# Altium project Elkapod_power_supply.PrjPcb (part 5 of 6)

## Sheet Logic_controller.SchDoc
size A3; SheetNumber: 7; SheetTotal: 10
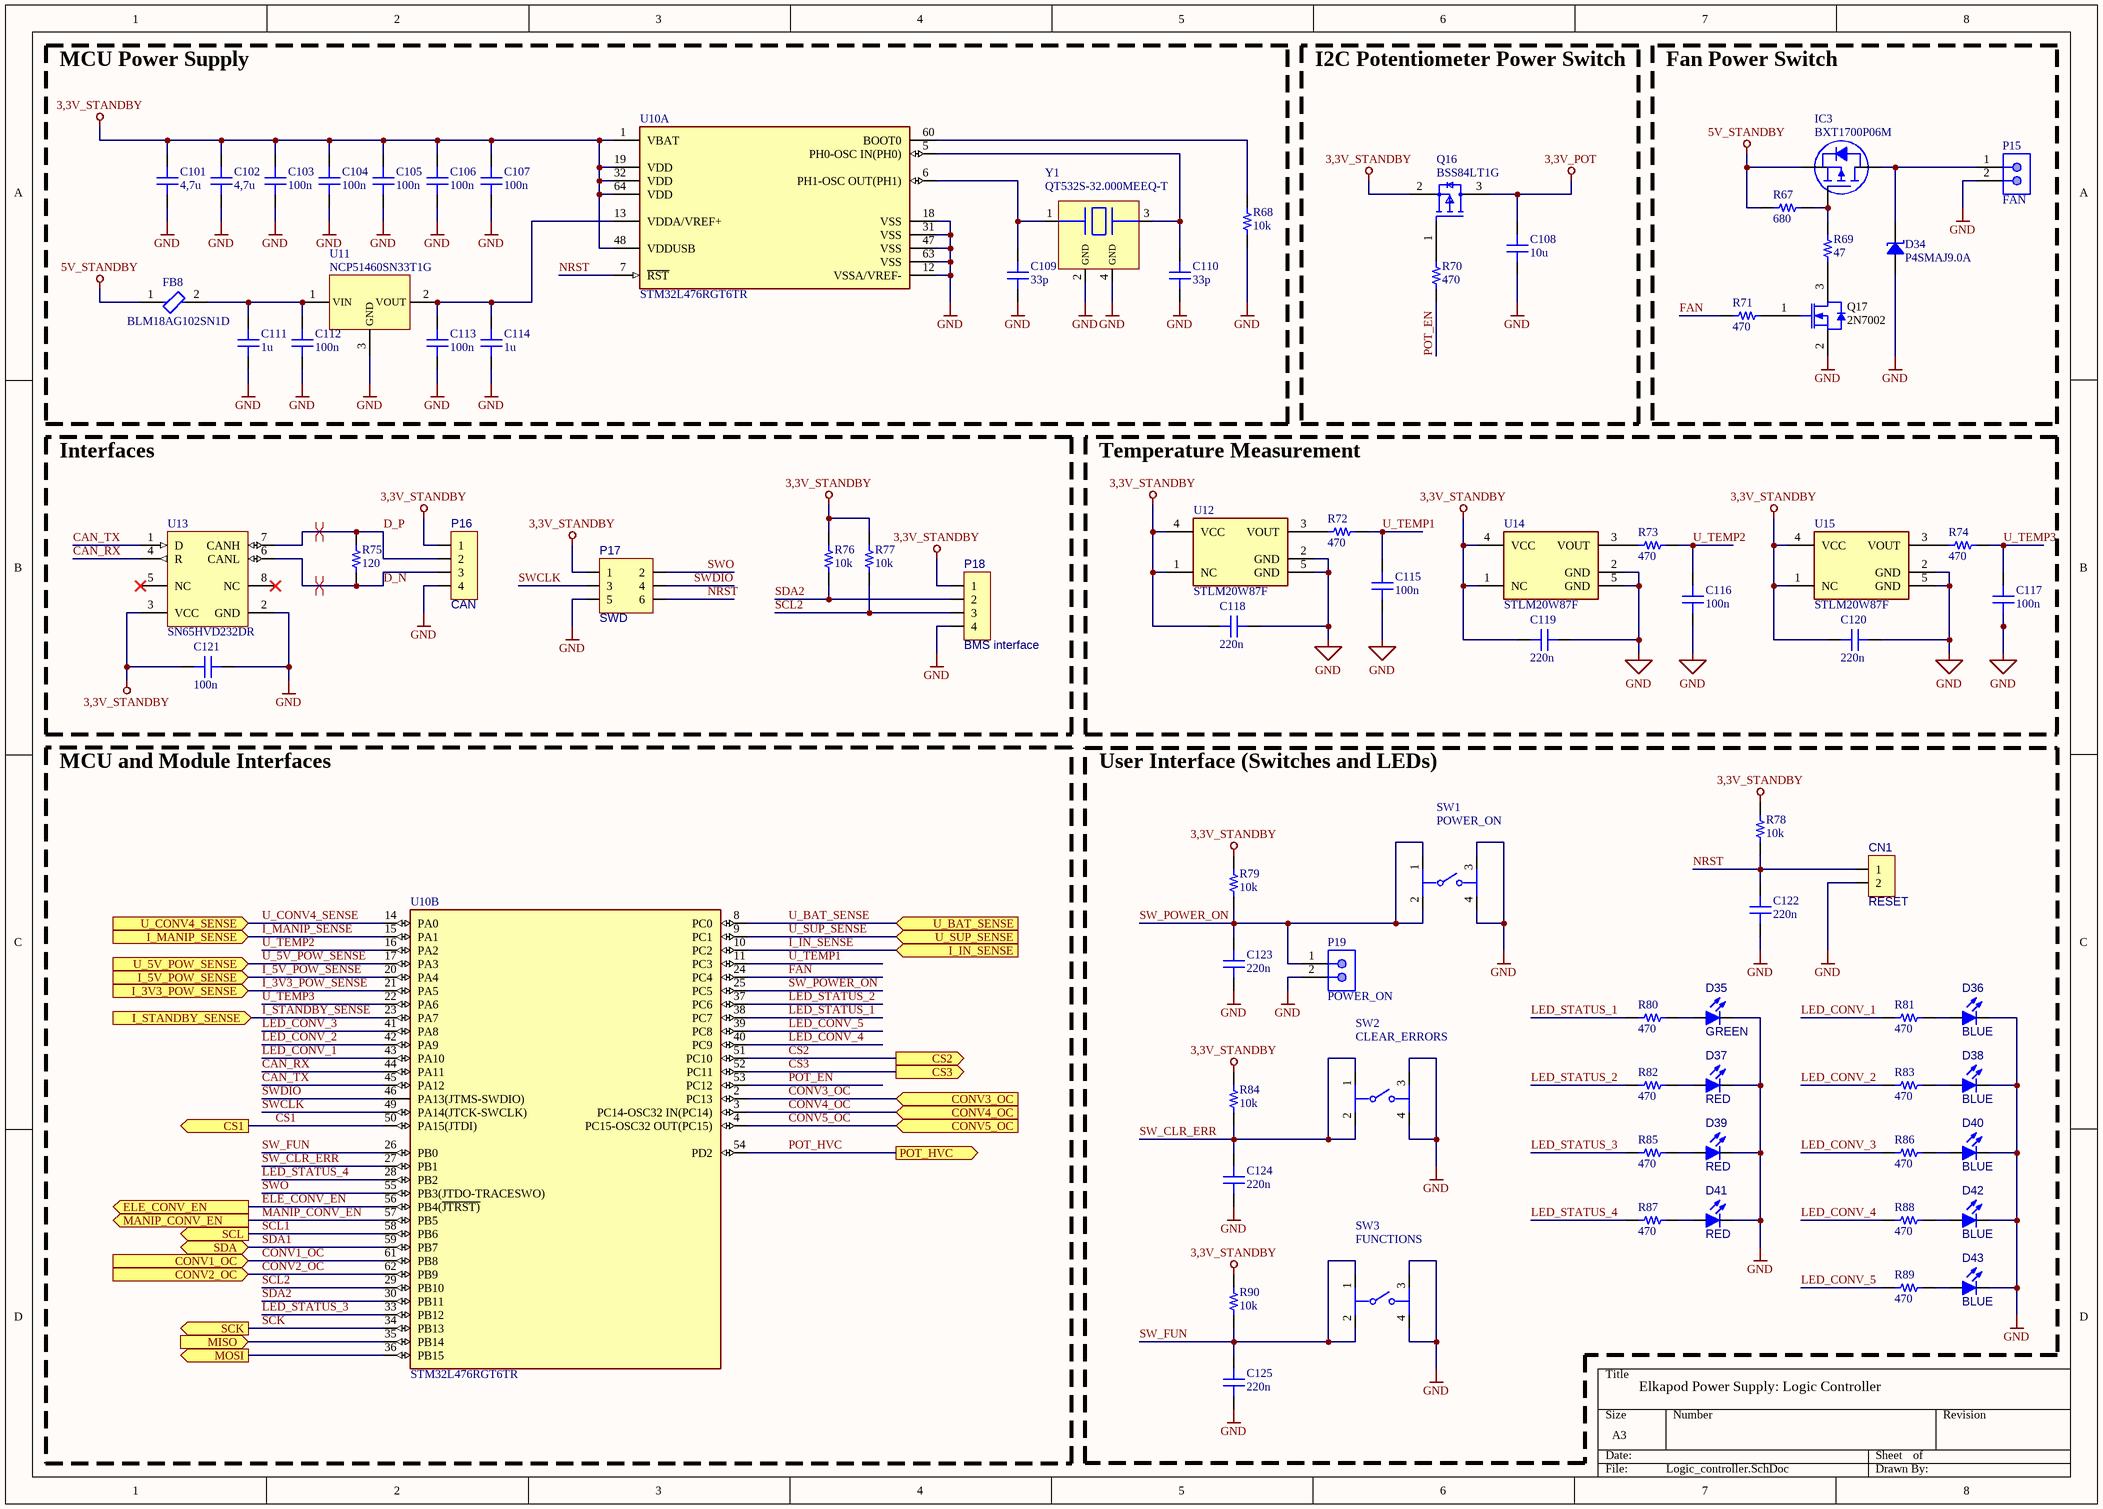
[diagram p9: Logic_controller.SchDoc]

### Parts
(Parts that share a designator on the sheet are numbered #1, #2 ... from top to bottom, then left to right.)
C101#2  4,7u  [CAP 0603_1608]
C102#2  4,7u  [CAP 0603_1608]
C103  100n  [CAP 0603_1608]
C104  100n  [CAP 0603_1608]
C105  100n  [CAP 0603_1608]
C106  100n  [CAP 0603_1608]
C107  100n  [CAP 0603_1608]
C108  10u  [CAP 0603_1608]
C109  33p  [CAP 0603_1608]
C110  33p  [CAP 0603_1608]
C111  1u  [CAP 0603_1608]
C112  100n  [CAP 0603_1608]
C113  100n  [CAP 0603_1608]
C114  1u  [CAP 0603_1608]
C115  100n  [CAP 0603_1608]
C116  100n  [CAP 0603_1608]
C117  100n  [CAP 0603_1608]
C118  220n  [CAP 0603_1608]
C119  220n  [CAP 0603_1608]
C120  220n  [CAP 0603_1608]
C121  100n  [CAP 0603_1608]
C122  220n  [CAP 0603_1608]
C123  220n  [CAP 0603_1608]
C124  220n  [CAP 0603_1608]
C125  220n  [CAP 0603_1608]
CN1  RESET  [GP_2x1]
D34  P4SMAJ9.0A  [DO214AC SMA]
D35  GREEN  [LED0805B]
D36  BLUE  [LED0805B]
D37  RED  [LED0805B]
D38  BLUE  [LED0805B]
D39  RED  [LED0805B]
D40  BLUE  [LED0805B]
D41  RED  [LED0805B]
D42  BLUE  [LED0805B]
D43  BLUE  [LED0805B]
FB8  BLM18AG102SN1D  [FP-BLM18-0_15-t0_8-MFG]
IC3  BXT1700P06M  [ON SEMI SOT-23-3]
P15  FAN  [MOLX-22-23-2021_V]
P16  CAN  [KK/2.54/4]
P17  SWD  [GP_3x2]
P18  BMS interface  [KK/2.54/4]
P19  POWER_ON  [MOLX-22-23-2021_V]
Q16#2  BSS84LT1G  [FP-318-08-IPC_A]
Q17  2N7002  [INF-PG-SOT23_M]
R67#2  680  [RES 0603_1608]
R68#2  10k  [RES 0603_1608]
R69#2  47  [RES 0603_1608]
R70#2  470  [RES 0603_1608]
R71#2  470  [RES 0603_1608]
R72#2  470  [RES 0603_1608]
R73#2  470  [RES 0603_1608]
R74  470  [RES 0603_1608]
R75  120  [RES 0603_1608]
R76  10k  [RES 0603_1608]
R77  10k  [RES 0603_1608]
R78  10k  [RES 0603_1608]
R79  10k  [RES 0603_1608]
R80  470  [RES 0603_1608]
R81  470  [RES 0603_1608]
R82  470  [RES 0603_1608]
R83  470  [RES 0603_1608]
R84  10k  [RES 0603_1608]
R85  470  [RES 0603_1608]
R86  470  [RES 0603_1608]
R87  470  [RES 0603_1608]
R88  470  [RES 0603_1608]
R89  470  [RES 0603_1608]
R90  10k  [RES 0603_1608]
SW1  POWER_ON  [FP-B3FS-1000-MFG]
SW2  CLEAR_ERRORS  [FP-B3FS-1000-MFG]
SW3  FUNCTIONS  [FP-B3FS-1000-MFG]
U10  STM32L476RGT6TR  [FP-LQFP64-5W-MFG]  (parts A,B of 2)
U11  NCP51460SN33T1G  [SOT23-3]
U12  STLM20W87F  [FP-SOT323-5L-7091413-MFG]
U13  SN65HVD232DR  [D0008A_M]
U14  STLM20W87F  [FP-SOT323-5L-7091413-MFG]
U15  STLM20W87F  [FP-SOT323-5L-7091413-MFG]
Y1  QT532S-32.000MEEQ-T  [QT532S_5,0x3,2_crystal]

### Blocks framed on the sheet
MCU Power Supply: C101#2 C102#2 C103-C107 C109-C114 FB8 R68#2 U10 U11 Y1
I2C Potentiometer Power Switch: C108 Q16#2 R70#2
Fan Power Switch: D34 IC3 P15 Q17 R67#2 R69#2 R71#2
Interfaces: C121 P16-P18 R75-R77 U13
Temperature Measurement: C115-C120 R72#2 R73#2 R74 U12 U14 U15
MCU and Module Interfaces: U10
User Interface (Switches and LEDs): C122-C125 CN1 D35-D43 P19 R78-R90 SW1-SW3

### Ports
CONV1_OC (in, see Elkapod_power_supply[8A]), CONV2_OC (in, see Elkapod_power_supply[8A]), CONV3_OC (in, see Elkapod_power_supply[8A]), CONV4_OC (in, see Elkapod_power_supply[8A]), CONV5_OC (in, see Elkapod_power_supply[8A]), CS1 (out, see Elkapod_power_supply[6A]), CS2 (out, see Elkapod_power_supply[6A]), CS3 (out, see Elkapod_power_supply[6A]), ELE_CONV_EN (out, see Elkapod_power_supply[8A]), I_3V3_POW_SENSE (in, see Elkapod_power_supply[6B]), I_5V_POW_SENSE (in, see Elkapod_power_supply[6B]), I_IN_SENSE (in, see Elkapod_power_supply[6A]), I_MANIP_SENSE (in, see Elkapod_power_supply[6A]), I_STANDBY_SENSE (in, see Elkapod_power_supply[6B]), MANIP_CONV_EN (out, see Elkapod_power_supply[8A]), MISO (in, see Elkapod_power_supply[6A], Servos_controller[4B]), MOSI (out, see Elkapod_power_supply[6A], Servos_controller[3B]), POT_HVC (out, see Elkapod_power_supply[8A]), SCK (out, see Elkapod_power_supply[6A]), SCL (out, see Elkapod_power_supply[6A], Controllable_voltage_outputs[2A], Electronics_power_supply_DC_converter[7C], Servos_controller[1C], Servos_DC_converter[5A]), SDA (bidir, see Elkapod_power_supply[6A], Controllable_voltage_outputs[2B], Electronics_power_supply_DC_converter[7C], Servos_controller[1C], Servos_DC_converter[5A]), U_5V_POW_SENSE (in, see Elkapod_power_supply[6A]), U_BAT_SENSE (in, see Elkapod_power_supply[6A]), U_CONV4_SENSE (in, see Elkapod_power_supply[6A]), U_SUP_SENSE (in, see Elkapod_power_supply[6A])

### Nets
3,3V_POT: C108.2 Q16#2.3(D)
3,3V_STANDBY: C101#2.2 C102#2.2 C103.2 C104.2 C105.2 C106.2 C107.2 C118.2 C119.2 C120.2 C121.2 P16.1 P17.1 P18.1 Q16#2.2(S) R76.1 R77.1 R78.1 R79.1 R84.1 R90.1 U10.1(VBAT) U10.19(VDD) U10.32(VDD) U10.48(VDDUSB) U10.64(VDD) U12.1(NC) U12.4(VCC) U13.3(VCC) U14.1(NC) U14.4(VCC) U15.1(NC) U15.4(VCC)
5V_STANDBY: FB8.1 IC3.2(S) R67#2.1
GND: C101#2.1 C102#2.1 C103.1 C104.1 C105.1 C106.1 C107.1 C108.1 C109.1 C110.1 C111.1 C112.1 C113.1 C114.1 C115.2 C116.2 C117.2 C118.1 C119.1 C120.1 C121.1 C122.1 C123.1 C124.1 C125.1 CN1.2 D34.1 D35.2(K) D36.2(K) D37.2(K) D38.2(K) D39.2(K) D40.2(K) D41.2(K) D42.2(K) D43.2(K) P15.2 P16.4 P17.5 P18.4 P19.2 Q17.2(SOURCE) R68#2.2 SW1.3 SW1.4 SW2.3 SW2.4 SW3.3 SW3.4 U10.12(VSSA/VREF-) U10.18(VSS) U10.31(VSS) U10.47(VSS) U10.63(VSS) U11.3(GND) U12.2(GND) U12.5(GND) U13.2(GND) U14.2(GND) U14.5(GND) U15.2(GND) U15.5(GND) Y1.2(GND) Y1.4(GND)  [project net AGND]
CAN_RX: U10.44(PA11) U13.4(R)  [project net CAN_RX_7]
CAN_TX: U10.45(PA12) U13.1(D)  [project net CAN_TX_7]
CONV1_OC: U10.61(PB8) ; port CONV1_OC
CONV2_OC: U10.62(PB9) ; port CONV2_OC
CONV3_OC: U10.2(PC13) ; port CONV3_OC
CONV4_OC: U10.3(PC14-OSC32_IN(PC14)) ; port CONV4_OC
CONV5_OC: U10.4(PC15-OSC32_OUT(PC15)) ; port CONV5_OC
CS1: U10.50(PA15(JTDI)) ; port CS1
CS2: U10.51(PC10) ; port CS2
CS3: U10.52(PC11) ; port CS3
D_N: P16.3 R75.2 U13.6(CANL)  [project net D_N_7]
D_P: P16.2 R75.1 U13.7(CANH)  [project net D_P_7]
ELE_CONV_EN: U10.56(PB4(~{JTRST)}) ; port ELE_CONV_EN
FAN: R71#2.1 U10.24(PC4)  [project net FAN_7]
I_3V3_POW_SENSE: U10.21(PA5) ; port I_3V3_POW_SENSE
I_5V_POW_SENSE: U10.20(PA4) ; port I_5V_POW_SENSE
I_IN_SENSE: U10.10(PC2) ; port I_IN_SENSE
I_MANIP_SENSE: U10.15(PA1) ; port I_MANIP_SENSE
I_STANDBY_SENSE: U10.23(PA7) ; port I_STANDBY_SENSE
LED_CONV_1: R81.2 U10.43(PA10)  [project net LED_CONV_1_7]
LED_CONV_2: R83.2 U10.42(PA9)  [project net LED_CONV_2_7]
LED_CONV_3: R86.2 U10.41(PA8)  [project net LED_CONV_3_7]
LED_CONV_4: R88.2 U10.40(PC9)  [project net LED_CONV_4_7]
LED_CONV_5: R89.2 U10.39(PC8)  [project net LED_CONV_5_7]
LED_STATUS_1: R80.2 U10.38(PC7)  [project net LED_STATUS_1_7]
LED_STATUS_2: R82.2 U10.37(PC6)  [project net LED_STATUS_2_7]
LED_STATUS_3: R85.2 U10.33(PB12)  [project net LED_STATUS_3_7]
LED_STATUS_4: R87.2 U10.28(PB2)  [project net LED_STATUS_4_7]
MANIP_CONV_EN: U10.57(PB5) ; port MANIP_CONV_EN
MISO: U10.35(PB14) ; port MISO
MOSI: U10.36(PB15) ; port MOSI
NRST: C122.2 CN1.1 P17.6 R78.2 U10.7(~{RST})  [project net NRST_7]
POT_EN: R70#2.2 U10.53(PC12)  [project net POT_EN_7]
POT_HVC: U10.54(PD2) ; port POT_HVC
SCK: U10.34(PB13) ; port SCK
SCL1: U10.58(PB6) ; port SCL  [project net SCL]
SCL2: P18.3 R77.2 U10.29(PB10)  [project net SCL2_7]
SDA1: U10.59(PB7) ; port SDA  [project net SDA]
SDA2: P18.2 R76.2 U10.30(PB11)  [project net SDA2_7]
SW_CLR_ERR: C124.2 R84.2 SW2.1 SW2.2 U10.27(PB1)  [project net SW_CLR_ERR_7]
SW_FUN: C125.2 R90.2 SW3.1 SW3.2 U10.26(PB0)  [project net SW_FUN_7]
SW_POWER_ON: C123.2 P19.1 R79.2 SW1.1 SW1.2 U10.25(PC5)  [project net SW_POWER_ON_7]
SWCLK: P17.3 U10.49(PA14(JTCK-SWCLK))  [project net SWCLK_7]
SWDIO: P17.4 U10.46(PA13(JTMS-SWDIO))  [project net SWDIO_7]
SWO: P17.2 U10.55(PB3(JTDO-TRACESWO))  [project net SWO_7]
U_5V_POW_SENSE: U10.17(PA3) ; port U_5V_POW_SENSE
U_BAT_SENSE: U10.8(PC0) ; port U_BAT_SENSE
U_CONV4_SENSE: U10.14(PA0) ; port U_CONV4_SENSE
U_SUP_SENSE: U10.9(PC1) ; port U_SUP_SENSE
U_TEMP1: C115.1 R72#2.2 U10.11(PC3)  [project net U_TEMP1_7]
U_TEMP2: C116.1 R73#2.2 U10.16(PA2)  [project net U_TEMP2_7]
U_TEMP3: C117.1 R74.2 U10.22(PA6)  [project net U_TEMP3_7]
NetC109_2: C109.2 U10.6(PH1-OSC_OUT(PH1)) Y1.1(OSC)
NetC110_2: C110.2 U10.5(PH0-OSC_IN(PH0)) Y1.3(OSC)
NetC111_2: C111.2 C112.2 FB8.2 U11.1(VIN)
NetC113_2: C113.2 C114.2 U10.13(VDDA/VREF+) U11.2(VOUT)
NetD34_2: D34.2 IC3.3(D) P15.1
NetD35_1: D35.1(A) R80.1
NetD36_1: D36.1(A) R81.1
NetD37_1: D37.1(A) R82.1
NetD38_1: D38.1(A) R83.1
NetD39_1: D39.1(A) R85.1
NetD40_1: D40.1(A) R86.1
NetD41_1: D41.1(A) R87.1
NetD42_1: D42.1(A) R88.1
NetD43_1: D43.1(A) R89.1
NetIC3_1: IC3.1(G) R67#2.2 R69#2.1
NetQ16#2_1: Q16#2.1(G) R70#2.1
NetQ17_1: Q17.1(GATE) R71#2.2
NetQ17_3: Q17.3(DRAIN) R69#2.2
NetR68#2_1: R68#2.1 U10.60(BOOT0)
NetR72#2_1: R72#2.1 U12.3(VOUT)
NetR73#2_1: R73#2.1 U14.3(VOUT)
NetR74_1: R74.1 U15.3(VOUT)

Not connected (* = marked no-connect by the designer): U13 5(NC)* 8(NC)*

### Layout directives
differential pair: D_N_7, D_P_7

### Notes on the sheet
- Elkapod Power Supply: Logic Controller

### Library data of the parts
C101#2 C102#2 = C0603C272F3GAC7867: CAP CER 4,7uF 25V X5R 0603; manufacturer: KEMET; Temperature Coefficient: C0G, NP0; Tolerance: ±1%; Part Number: C0603C272F3GAC7867; Value: 4,7u; Applications: General Purpose; Capacitance: 4,7u; componentlink1description: Datasheet; componentlink1url: https://api.kemet.com/component-edge/download/datasheet/C0603C272F3GACTU.pdf; componentlink2description: DigiKey Link; componentlink2url: https://www.digikey.com/en/products/detail/kemet/C0603C272F3GAC7867/2200413; Device Package: 0603 (1608 Metric); Features: Low ESL; lastupdated: 09.02.2024 20:10:30; Lifecycle Status: Active; Minimum Order: 1; Mounting Type: Surface Mount, MLCC; Operating Temperature: -55°C ~ 125°C; Package / Case: 0603 (1608 Metric); packaging: TapeAndReel; partid: 2138; Part Status: Active; price: 0.40; series: SMD Comm C0G; Size / Dimension: 0.063" L x 0.031" W (1.60mm x 0.80mm); Thickness (Max): 0.034" (0.87mm); Voltage - Rated: 25V
C103-C107 C112 C113 C115-C117 C121 = C0603C272F3GAC7867: CAP CER 100nF 25V X5R 0603; manufacturer: KEMET; Temperature Coefficient: C0G, NP0; Tolerance: ±1%; Part Number: C0603C272F3GAC7867; Value: 100n; Applications: General Purpose; Capacitance: 100n; componentlink1description: Datasheet; componentlink1url: https://api.kemet.com/component-edge/download/datasheet/C0603C272F3GACTU.pdf; componentlink2description: DigiKey Link; componentlink2url: https://www.digikey.com/en/products/detail/kemet/C0603C272F3GAC7867/2200413; Device Package: 0603 (1608 Metric); Features: Low ESL; lastupdated: 09.02.2024 20:10:30; Lifecycle Status: Active; Minimum Order: 1; Mounting Type: Surface Mount, MLCC; Operating Temperature: -55°C ~ 125°C; Package / Case: 0603 (1608 Metric); packaging: TapeAndReel; partid: 2138; Part Status: Active; price: 0.40; series: SMD Comm C0G; Size / Dimension: 0.063" L x 0.031" W (1.60mm x 0.80mm); Thickness (Max): 0.034" (0.87mm); Voltage - Rated: 25V
C108 = C0603C272F3GAC7867: CAP CER 10uF 35V X5R 0603; manufacturer: KEMET; Temperature Coefficient: C0G, NP0; Tolerance: ±1%; Voltage - Rated: 25V; Part Number: C0603C272F3GAC7867; Value: 10u; Applications: General Purpose; Capacitance: 10u; componentlink1description: Datasheet; componentlink1url: https://api.kemet.com/component-edge/download/datasheet/C0603C272F3GACTU.pdf; componentlink2description: DigiKey Link; componentlink2url: https://www.digikey.com/en/products/detail/kemet/C0603C272F3GAC7867/2200413; Device Package: 0603 (1608 Metric); Features: Low ESL; lastupdated: 09.02.2024 20:10:30; Lifecycle Status: Active; Minimum Order: 1; Mounting Type: Surface Mount, MLCC; Operating Temperature: -55°C ~ 125°C; Package / Case: 0603 (1608 Metric); packaging: TapeAndReel; partid: 2138; Part Status: Active; price: 0.40; series: SMD Comm C0G; Size / Dimension: 0.063" L x 0.031" W (1.60mm x 0.80mm); Thickness (Max): 0.034" (0.87mm)
C109 C110 = C0603C272F3GAC7867: CAP CER 33pF 50V G0C 0603; manufacturer: KEMET; Temperature Coefficient: C0G, NP0; Tolerance: ±1%; Voltage - Rated: 25V; Part Number: C0603C272F3GAC7867; Value: 33p; Applications: General Purpose; Capacitance: 33p; componentlink1description: Datasheet; componentlink1url: https://api.kemet.com/component-edge/download/datasheet/C0603C272F3GACTU.pdf; componentlink2description: DigiKey Link; componentlink2url: https://www.digikey.com/en/products/detail/kemet/C0603C272F3GAC7867/2200413; Device Package: 0603 (1608 Metric); Features: Low ESL; lastupdated: 09.02.2024 20:10:30; Lifecycle Status: Active; Minimum Order: 1; Mounting Type: Surface Mount, MLCC; Operating Temperature: -55°C ~ 125°C; Package / Case: 0603 (1608 Metric); packaging: TapeAndReel; partid: 2138; Part Status: Active; price: 0.40; series: SMD Comm C0G; Size / Dimension: 0.063" L x 0.031" W (1.60mm x 0.80mm); Thickness (Max): 0.034" (0.87mm)
C111 C114 = C0603C272F3GAC7867: CAP CER 1uF 16V X5R 0603; manufacturer: KEMET; Temperature Coefficient: C0G, NP0; Tolerance: ±1%; Voltage - Rated: 25V; Part Number: C0603C272F3GAC7867; Value: 1u; Applications: General Purpose; Capacitance: 1u; componentlink1description: Datasheet; componentlink1url: https://api.kemet.com/component-edge/download/datasheet/C0603C272F3GACTU.pdf; componentlink2description: DigiKey Link; componentlink2url: https://www.digikey.com/en/products/detail/kemet/C0603C272F3GAC7867/2200413; Device Package: 0603 (1608 Metric); Features: Low ESL; lastupdated: 09.02.2024 20:10:30; Lifecycle Status: Active; Minimum Order: 1; Mounting Type: Surface Mount, MLCC; Operating Temperature: -55°C ~ 125°C; Package / Case: 0603 (1608 Metric); packaging: TapeAndReel; partid: 2138; Part Status: Active; price: 0.40; series: SMD Comm C0G; Size / Dimension: 0.063" L x 0.031" W (1.60mm x 0.80mm); Thickness (Max): 0.034" (0.87mm)
C118-C120 C122-C125 = C0603C272F3GAC7867: CAP CER 220nF 25V X5R 0603; manufacturer: KEMET; Temperature Coefficient: C0G, NP0; Tolerance: ±1%; Part Number: C0603C272F3GAC7867; Value: 220n; Applications: General Purpose; Capacitance: 220n; componentlink1description: Datasheet; componentlink1url: https://api.kemet.com/component-edge/download/datasheet/C0603C272F3GACTU.pdf; componentlink2description: DigiKey Link; componentlink2url: https://www.digikey.com/en/products/detail/kemet/C0603C272F3GAC7867/2200413; Device Package: 0603 (1608 Metric); Features: Low ESL; lastupdated: 09.02.2024 20:10:30; Lifecycle Status: Active; Minimum Order: 1; Mounting Type: Surface Mount, MLCC; Operating Temperature: -55°C ~ 125°C; Package / Case: 0603 (1608 Metric); packaging: TapeAndReel; partid: 2138; Part Status: Active; price: 0.40; series: SMD Comm C0G; Size / Dimension: 0.063" L x 0.031" W (1.60mm x 0.80mm); Thickness (Max): 0.034" (0.87mm); Voltage - Rated: 25V
CN1 = CN_2x1
D34 = SMA6J18A-TP: TVS DIODE 9VDC DO214AC; Part Number: P4SMAJ9.0A
D35 = LED_BLUE: GREEN LED; Published: 04-Apr-2006
D36 D38 D40 D42 D43 = LED_BLUE: BLUE LED; Published: 04-Apr-2006
D37 D39 D41 = LED_BLUE: RED LED; Published: 04-Apr-2006
FB8 = CMP-0686-00457-3: Chip Ferrite Bead, 0603, 1000Ω @ 100MHz, 0.5Ω, 25%, 450mA; Number of Circuits: 1; Max DC Current: 400mA; Shielding: Unshielded; DC Resistance (DCR): 500mR; Material: Steel; DC Resistance-Max: 700mR; Impedance: 1kR; Case Code (Imperial): 0603; Max Current Rating: 400mA; Frequency: 100MHz; Min Operating Temperature: -55°C; Case/Package: 0603; Depth: 0.8mm; Lead Free: Lead Free; Core Material: Ferrite; Current Rating: 400mA; Resistance: 500mR; Case Code (Metric): 1608; DC Current: 400mA; Package Quantity: 1; Packaging: Tape and Reel; Width: 0.8mm; Military Standard: Not; Height: 0.8mm; Series: BLM18A; Max Operating Temperature: 125°C; Tolerance: 25%; Termination: SMD/SMT; Test Frequency: 100MHz; Number of Lines: 1; Number of Pins: 2; REACH SVHC: No SVHC; Length: 1.6mm; Radiation Hardening: No
IC3 = NTRV4101PT1G: MOSFET P-CH 60V 2.8A SOT-23-3; Part Number: BXT1700P06M
P15 P19 = CMP-1704-00001-3: Male Header, Pitch 2.54 mm, 1 x 2 Position, Height 10.67 mm, Tail Length 3.56 mm, 0 to 75 degC, RoHS, Bulk; Package Quantity: 3000; Height: 10.67 mm; RoHSCompliant: True; ComponentLink2URL: https://datasheet.ciiva.com/19454/232266-19454304.pdf; PartNumber: 22-23-2021; Packaging: Bulk; ComponentLink2Description: Datasheet; Min Operating Temperature: 0 degC; ComponentLink1Description: Manufacturer URL; Length: 5.08 mm; Mounting Technology: Through Hole; Max Operating Temperature: 75 degC; REACH SVHC: Unknown; PackageDescription: Male Header, Pitch 2.54 mm, 1 x 2 Position, Height 10.67 mm, Tail Length 3.56 mm; ComponentLink1URL: http://www.molex.com/; Mount: Through Hole; Radiation Hardening: No; Width: 6.35 mm; Pins: 2
P16 P18 = CN_4x1: Connector: PCB-cable; KK; socket; male; PIN:4; straight/right-angle; tinned; THT
P17 = CN_3x2
Q16#2 = CMP-1058-00762-2: MOSFET P-CH 50V 130MA SOT-23; Max Power Dissipation: 225mW; On-State Resistance: 10R; Nominal Vgs: 2V; Gate to Source Voltage (Vgs): 20V; Rise Time: 1ns; Turn-Off Delay Time: 16ns; Voltage Rating (DC): -50V; Turn-On Delay Time: 3.6ns; Number of Elements: 1; Current Rating: -130mA; Input Capacitance: 30pF; Threshold Voltage: -2V; Element Configuration: Single; Drain to Source Breakdown Voltage: 50V; Continuous Drain Current (ID): 130mA; Length: 0.119inch; Drain to Source Voltage (Vdss): 50V; Min Operating Temperature: -55°C; Contact Plating: Tin; Lead Free: Lead Free; Width: 0.055inch; Case/Package: SOT-23-3; Max Operating Temperature: 150°C; Halogen Free: Halogen Free; Radiation Hardening: No; Drain to Source Resistance: 10R; REACH SVHC: No SVHC; Power Dissipation: 225mW; Number of Pins: 3; Package Quantity: 1; Packaging: Tape and Reel; Fall Time: 1ns; Rds On Max: 10R; Height: 0.04inch
Q17 = CMP-1149-00026-1: N-Channel OptiMOS Small-Signal-Transistor, 60 V VDS, 0.3 A ID, -55 to 150 degC, PG-SOT23, Reel, Green; Manufacturer: Infineon; RDS (on) (max) (@4.5V): 4,000 mOhm; VDS (max): 60 V; IDpuls (max): 1.2Â A; QG: 0.4Â nC; RDS (on) (max): 3,000 mOhm; RthJA (max): 250 K/W; ID (max): 0.3Â A; VGS(th) (max): 2.5Â V; VGS(th) (min): 1.5Â V; Green: TRUE; Ptot (max): 0.5Â W; PackageDescription: 3-Pin Small Outline Transistor Package, 2.9 x 1.3 mm Body, 0.95 mm Pitch; Halogen-free: TRUE; ComponentLink2Description: Datasheet; ComponentLink1URL: http://www.infineon.com/; Packing: Reel; DatasheetVersion: Rev. 2.4; PartNumber: 2N7002; PackageReference: PG-SOT23; PackageVersion: Apr-08; ComponentLink3URL: http://www.infineon.com/dgdl/SOT23-Package_Overview.pdf?folderId=db3a30431936bc4b0119532290053c66&fileId=db3a30431936bc4b0119533468123c85; ComponentLink1Description: Manufacturer URL; Mounting Technology: Surface Mount; ComponentLink3Description: Package Specification; ComponentLink2URL: http://www.infineon.com/dgdl/2N7002_Rev2.4.pdf?folderId=db3a3043156fd573011622e10b5c1f67&fileId=db3a304319bc939a0119c2a9461e79e6
R67#2 = RNCS0603BKE10K0: RES 680 OHM 1% 0,1W 0603; Manufacturer: Stackpole Electronics Inc; Power (Watts): 0.063W, 1/16W; Temperature Coefficient: ±25ppm/°C; Tolerance: ±0.1%; Part Number: RNCS0603BKE10K0; Value: 680; Composition: Thin Film; Device Package: 0603 (1608 Metric); Features: Anti-Corrosive, Automotive AEC-Q200, Moisture Resistant; Height - Seated (Max): 0.022" (0.55mm); LastUpdated: 09.02.2024 20:43:37; Lifecycle Status: Active; Minimum Order: 1; Number of Terminations: 2; Operating Temperature: -55°C ~ 155°C; Package / Case: 0603 (1608 Metric); Packaging: TapeAndReel; PartId: 4838; Part Status: Active; Price: 0.06; Ratings: AEC-Q200; Resistance: 680; Series: RNCS; Size / Dimension: 0.061" L x 0.031" W (1.55mm x 0.80mm); Supplier Device Package: 0603
R68#2 R76-R79 R84 R90 = RNCS0603BKE10K0: RES 10K OHM 1% 0,1W 0603; Manufacturer: Stackpole Electronics Inc; Power (Watts): 0.063W, 1/16W; Temperature Coefficient: ±25ppm/°C; Tolerance: ±0.1%; Part Number: RNCS0603BKE10K0; Value: 10k; Composition: Thin Film; Device Package: 0603 (1608 Metric); Features: Anti-Corrosive, Automotive AEC-Q200, Moisture Resistant; Height - Seated (Max): 0.022" (0.55mm); LastUpdated: 09.02.2024 20:43:37; Lifecycle Status: Active; Minimum Order: 1; Number of Terminations: 2; Operating Temperature: -55°C ~ 155°C; Package / Case: 0603 (1608 Metric); Packaging: TapeAndReel; PartId: 4838; Part Status: Active; Price: 0.06; Ratings: AEC-Q200; Resistance: 10k; Series: RNCS; Size / Dimension: 0.061" L x 0.031" W (1.55mm x 0.80mm); Supplier Device Package: 0603
R69#2 = RNCS0603BKE10K0: RES 47 OHM 1% 0,1W 0603; Manufacturer: Stackpole Electronics Inc; Power (Watts): 0.063W, 1/16W; Temperature Coefficient: ±25ppm/°C; Tolerance: ±0.1%; Part Number: RNCS0603BKE10K0; Value: 47; Composition: Thin Film; Device Package: 0603 (1608 Metric); Features: Anti-Corrosive, Automotive AEC-Q200, Moisture Resistant; Height - Seated (Max): 0.022" (0.55mm); LastUpdated: 09.02.2024 20:43:37; Lifecycle Status: Active; Minimum Order: 1; Number of Terminations: 2; Operating Temperature: -55°C ~ 155°C; Package / Case: 0603 (1608 Metric); Packaging: TapeAndReel; PartId: 4838; Part Status: Active; Price: 0.06; Ratings: AEC-Q200; Resistance: 47; Series: RNCS; Size / Dimension: 0.061" L x 0.031" W (1.55mm x 0.80mm); Supplier Device Package: 0603
R70#2 R71#2 R72#2 R73#2 R74 R80-R83 R85-R89 = RNCS0603BKE10K0: RES 470 OHM 1% 0,1W 0603; Manufacturer: Stackpole Electronics Inc; Power (Watts): 0.063W, 1/16W; Temperature Coefficient: ±25ppm/°C; Tolerance: ±0.1%; Part Number: RNCS0603BKE10K0; Value: 470; Composition: Thin Film; Device Package: 0603 (1608 Metric); Features: Anti-Corrosive, Automotive AEC-Q200, Moisture Resistant; Height - Seated (Max): 0.022" (0.55mm); LastUpdated: 09.02.2024 20:43:37; Lifecycle Status: Active; Minimum Order: 1; Number of Terminations: 2; Operating Temperature: -55°C ~ 155°C; Package / Case: 0603 (1608 Metric); Packaging: TapeAndReel; PartId: 4838; Part Status: Active; Price: 0.06; Ratings: AEC-Q200; Resistance: 470; Series: RNCS; Size / Dimension: 0.061" L x 0.031" W (1.55mm x 0.80mm); Supplier Device Package: 0603
R75 = RNCS0603BKE10K0: RES 120 OHM 1% 0,1W 0603; Manufacturer: Stackpole Electronics Inc; Power (Watts): 0.063W, 1/16W; Temperature Coefficient: ±25ppm/°C; Tolerance: ±0.1%; Part Number: RNCS0603BKE10K0; Value: 120; Composition: Thin Film; Device Package: 0603 (1608 Metric); Features: Anti-Corrosive, Automotive AEC-Q200, Moisture Resistant; Height - Seated (Max): 0.022" (0.55mm); LastUpdated: 09.02.2024 20:43:37; Lifecycle Status: Active; Minimum Order: 1; Number of Terminations: 2; Operating Temperature: -55°C ~ 155°C; Package / Case: 0603 (1608 Metric); Packaging: TapeAndReel; PartId: 4838; Part Status: Active; Price: 0.06; Ratings: AEC-Q200; Resistance: 120; Series: RNCS; Size / Dimension: 0.061" L x 0.031" W (1.55mm x 0.80mm); Supplier Device Package: 0603
SW1-SW3 = CMP-08834-000004-1: SWITCH TACTILE SPST-NO 0.05A 24V; Manufacturer: Omron Electronics Inc-EMC Div; Manufacturer Part Number: B3FS-1000; Operating Force: 0.98N; Contact Current Rating: 50mA; Electromechanical Life: 1000000Cycles; Contact Resistance: 100mΩ; Mouser Description: Tactile Switches 6X6X3.1mm 100gF; Height: 3.3mm; Lead Free: Yes; Device Class L1: Electromechanical; RoHS: TRUE; Voltage Rating Dc: 24V; Temperature Range High: +70°C; ComponentLink2Description: Datasheet; Temperature Range Low: -25°C; Temperature: -25°C to +70°C; ComponentLink2URL: https://omronfs.omron.com/en_US/ecb/products/pdf/en-b3fs.pdf; Throw Configuration: SPST-NO; Package: 0; Ambient Temperature Range Low: -25°C; Octopart: https://octopart.com/b3fs-1000-omron-116581; Device Class L3: Tactile Switches; Category: Switch; Automotive: No; Device Class L2: Switches; Ambient Temperature Range High: +70°C; Mount: Surface Mount; Digikey Description: SWITCH TACTILE SPST-NO 0.05A 24V
U10 = CMP-12105-000039-1: IC MCU 32BIT 1MB FLASH 64LQFP; Manufacturer: STMicroelectronics; Number Of Timers/Counters: 13; Number Of Spi Channels: 3; Number Of Pwm Channels: 28; Number Of Usb Channels: 1; Frequency: 80MHz; Data Bus Width: 32bits; Max Supply Voltage: 3.6V; Ram Size: 128KBytes; Memory Size: 1MBytes; Number Of Uart Channels: 6; Number Of Adc Channels: 16; Core Architecture: ARM Cortex-M4; Standoff Height: 0.05mm; Interface: I2C,SPI,UART,USART,CAN,USB,LIN,IrDA,SMBus,Other; Max Junction Temp: +105°C; Min Supply Voltage: 1.71V; Number Of I/Os: 51; Temperature Range Low: -40°C; Automotive: No; Ambient Temperature Range Low: -40°C; ComponentLink2URL: https://www.st.com/content/ccc/resource/technical/document/datasheet/c5/ed/2f/60/aa/79/42/0b/DM00108832.pdf/files/DM00108832.pdf/jcr:content/translations/en.DM00108832.pdf; Temperature: -40°C to +105°C; Device Class L1: Integrated Circuits (ICs); Package: LQFP64-5W; Category: IC; Memory Type: FLASH; Digikey Description: IC MCU 32BIT 1MB FLASH 64LQFP; Number Of A/D Converters: 3; Number Of I2C Channels: 3; Temperature Range High: +105°C; Lead Free: Yes; Number Of Cores: 1; Height: 1.6mm; Ambient Temperature Range High: +85°C; Device Class L2: Embedded Processors and Controllers; Octopart: https://octopart.com/stm32l476rgt6tr-stmicroelectronics-74146120; RoHS: TRUE; Ipc Land Pattern Name: QFP50P1200X1200X160-64; Mouser Description: MCU 32-Bit STM32 ARM Cortex M4 RISC 1MB Flash 1.8V/2.5V/3.3V 64-Pin LQFP T/R; ComponentLink2Description: Datasheet; Manufacturer Part Number: STM32L476RGT6TR; Device Class L3: Microcontrollers
U11 = NCP51460SN33T1G: Low power precision voltage reference; Iout = 20mA
U12 U14 U15 = CMP-12184-000003-1: SENSOR ANALOG -55C-130C SOT323-5; Manufacturer: STMicroelectronics; Max Junction Temp: +150°C; Standoff Height: 0mm; Operating Supply Current: 4.8uA; Max Supply Voltage: 5.5V; Output Current: 10mA; Sensor Output: Analog Voltage; Min Supply Voltage: 2.4V; Output Voltage: 1.8639V; Temperature Range High: +130°C; Digikey Description: SENSOR ANALOG -55C-130C SOT323-5; Temperature: -55°C to +130°C; Mouser Description: Temperature Sensor Ic, Voltage, 1.5 C, -55 C, +130 C, Sc-70, 5 Rohs Compliant: Yes; Device Class L3: unset; Category: IC; Device Class L1: Sensors; Lead Free: Yes; ComponentLink2URL: https://www.st.com/resource/en/datasheet/stlq020.pdf; Package: SOT323-5L-7091413; Temperature Range Low: -55°C; Ambient Temperature Range Low: -55°C; Automotive: No; Manufacturer Part Number: STLM20W87F; Ambient Temperature Range High: +130°C; RoHS: TRUE; Octopart: https://octopart.com/stlm20w87f-stmicroelectronics-4006294; Height: 1.1mm; ComponentLink2Description: Datasheet; Ipc Land Pattern Name: SOT65P210X95-5; Device Class L2: Temperature and Humidity Sensors
U13 = CMP-0315-00075-2: 3.3 V Can Transceiver, 17 mA, -40 to 85 degC, 8-pin SOIC (D), Green (RoHS & no Sb/Br); Manufacturer: Texas Instruments; Supply Voltage(s)(V): 3.3; Receivers Per Package: 1; ICC(Max)(mA): 17; Rating: Catalog; Transient Pulse Protection(V): -25 to 25; Mounting Technology: Surface Mount; PartNumber: SN65HVD232DR; Code_JEDEC: MS-012AA; Eco-Plan: Green (RoHS & no Sb/Br); Isolated: No; SubFamily: CAN; Footprint: SN65HVD232; Drivers Per Package: 1; ComponentLink1URL: http://www.ti.com/general/docs/lit/getliterature.tsp?genericPartNumber=SN65HVD232&fileType=pdf; ComponentLink1Description: Datasheet; PackageDescription: 8-Pin Plastic Small Outline Integrated Circuit, 4.9 x 3.9 mm, Pitch 1.27 mm Pitch; PackageReference: D0008A; DatasheetVersion: SLOS346K; PackageVersion: revM, Jun-2011
Y1 = QT532S_CRYSTAL